# Altium schematic sheet RasBOB_board.SchDoc: RP2040 CNC
size C; Author: AM; CompanyName: Expatria Technologies; DrawnBy: A.Marles; Engineer: AM; Organization: Expatria Technolgoies; Address1: Schematic; DocumentNumber: 2; SheetNumber: 2; SheetTotal: 4
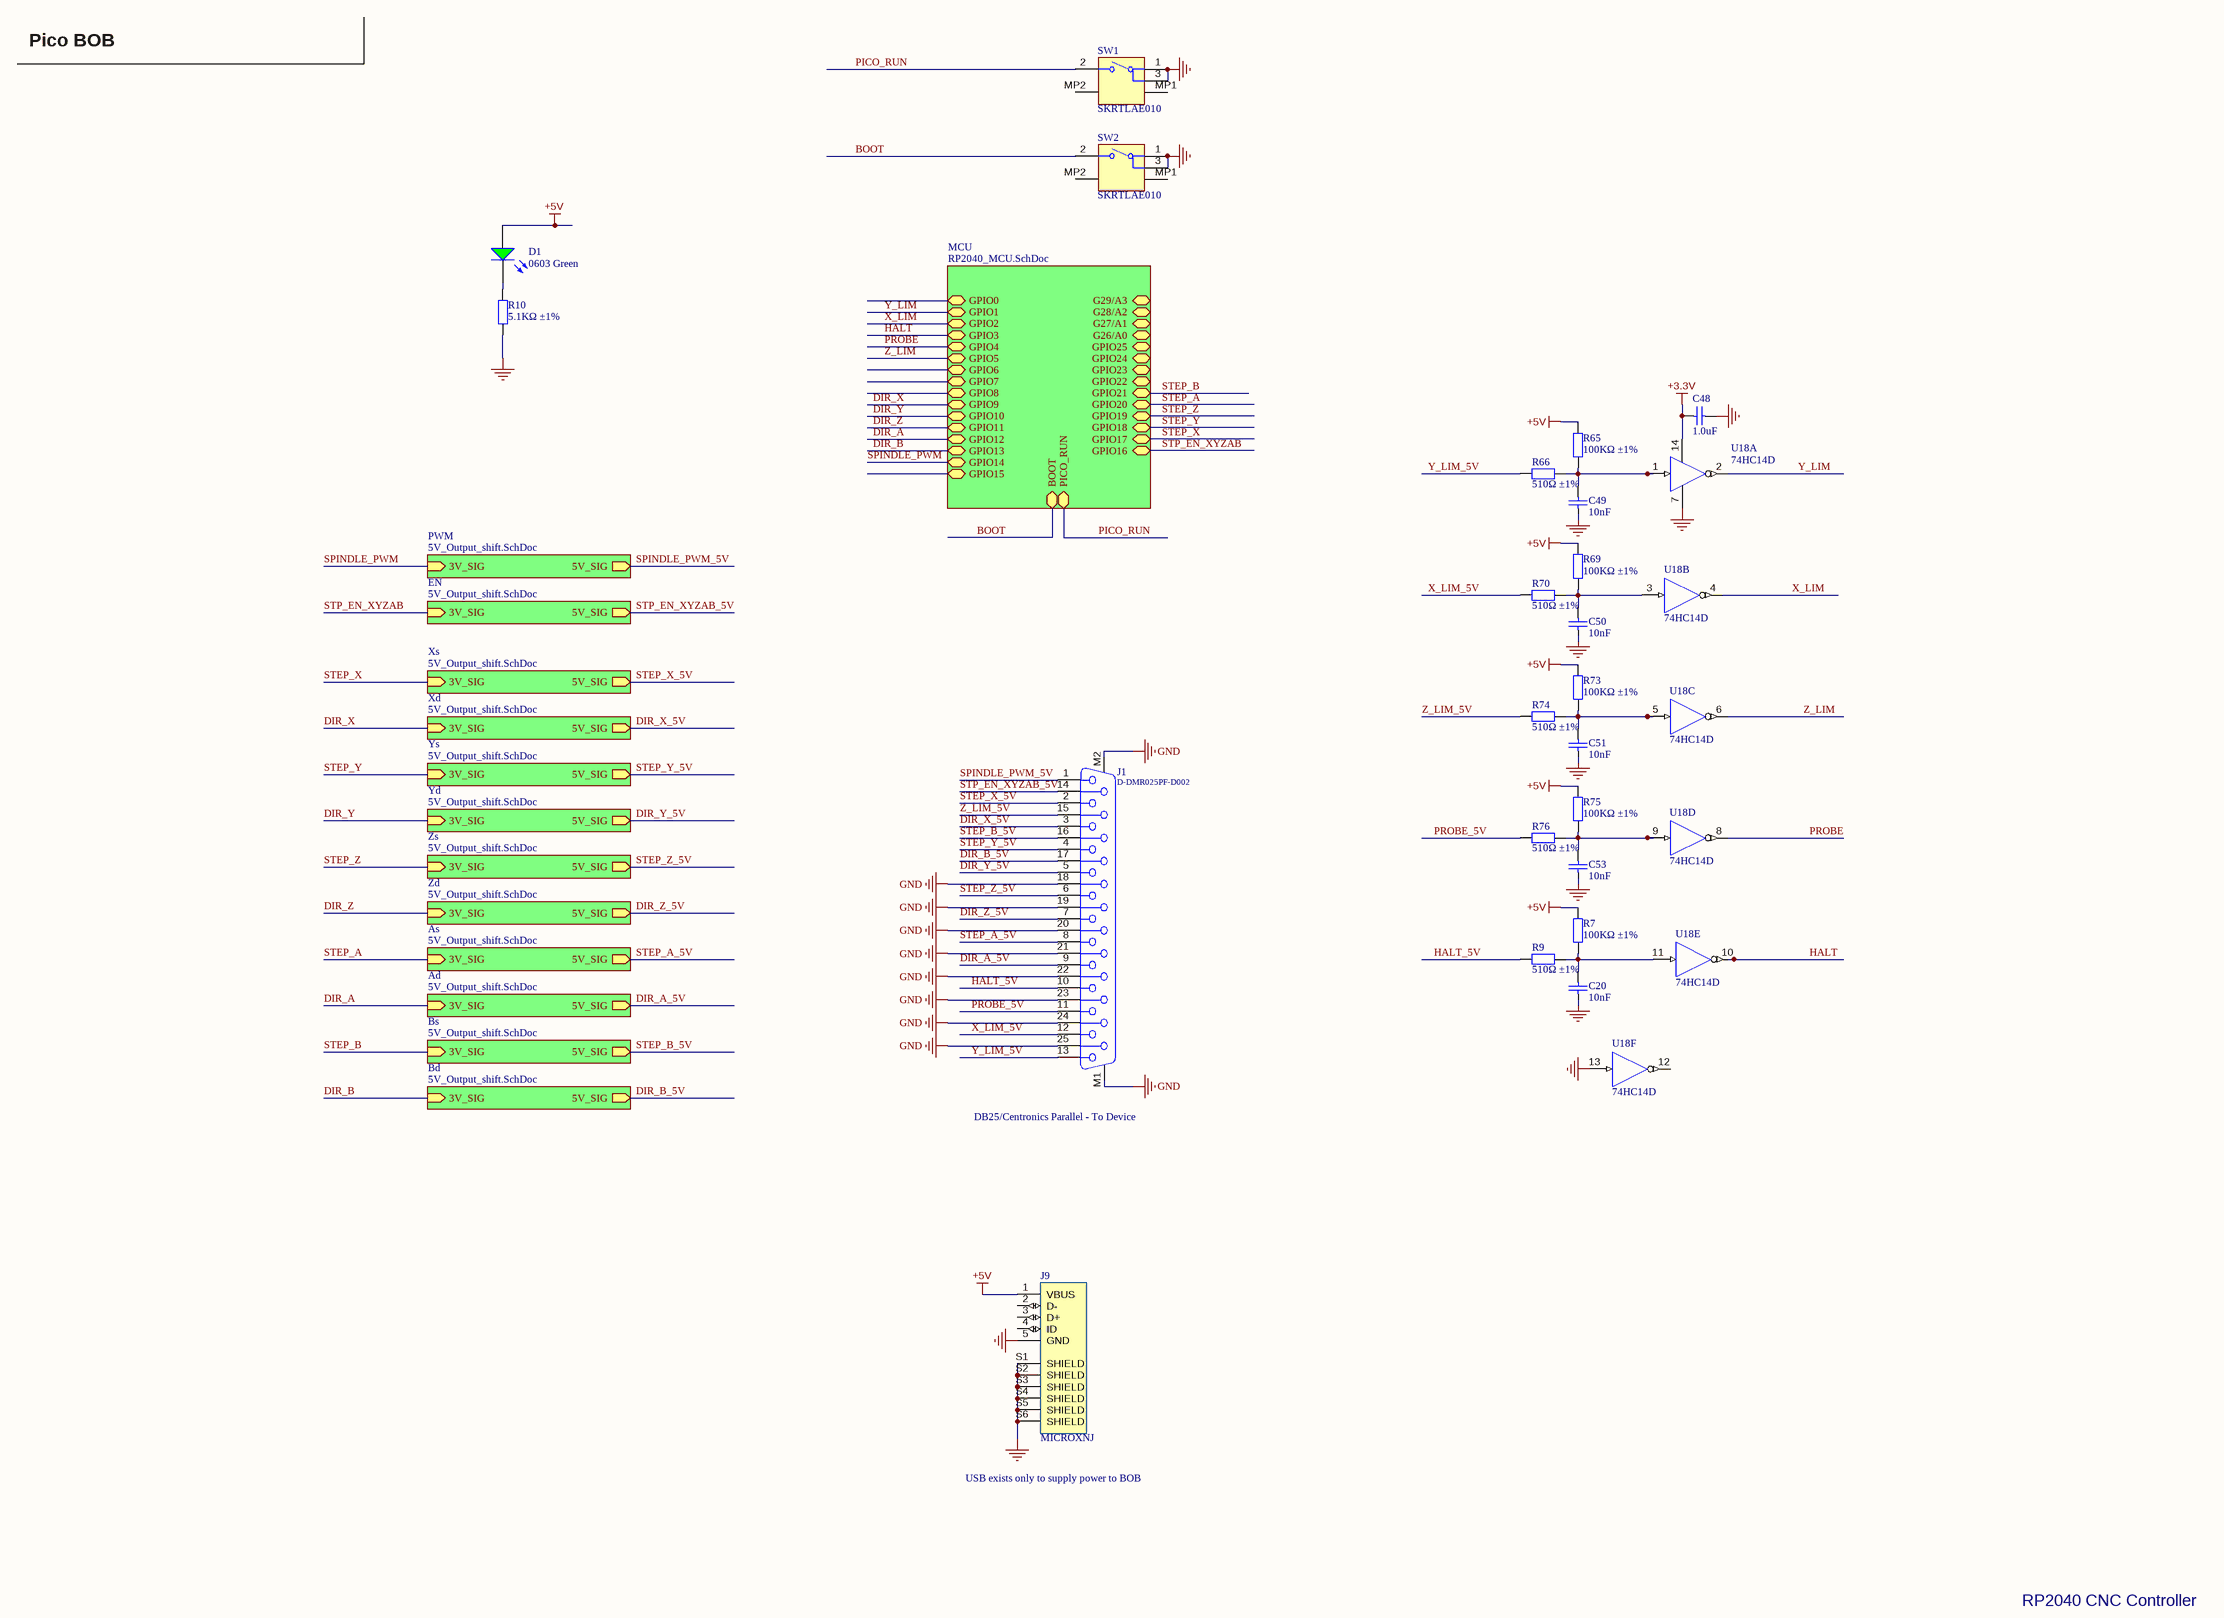
[diagram p0: RasBOB_board.SchDoc]

## Parts
C20  10nF  [0402_C]
C48  1.0uF  [0402_C]
C49  10nF  [0402_C]
C50  10nF  [0402_C]
C51  10nF  [0402_C]
C53  10nF  [0402_C]
D1  0603 Green  [0603_LED_S1]
J1  D-DMR025PF-D002  [618025231121]
J9  MICROXNJ  [SHOUHAN_MICROXNJ]
R7  100KΩ ±1%  [0402_R]
R9  510Ω ±1%  [0402_R]
R10  5.1KΩ ±1%  [0402_R]
R65  100KΩ ±1%  [0402_R]
R66  510Ω ±1%  [0402_R]
R69  100KΩ ±1%  [0402_R]
R70  510Ω ±1%  [0402_R]
R73  100KΩ ±1%  [0402_R]
R74  510Ω ±1%  [0402_R]
R75  100KΩ ±1%  [0402_R]
R76  510Ω ±1%  [0402_R]
SW1  SKRTLAE010  [ALPS-SKRTLAE010_V]
SW2  SKRTLAE010  [ALPS-SKRTLAE010_V]
U18  74HC14D  [SOIC-14_150mil]  (parts A,B,C,D,E,F of 6)

## Sub-sheets
Ad = 5V_Output_shift.SchDoc: 3V_SIG (in), 5V_SIG (out)
As = 5V_Output_shift.SchDoc: 3V_SIG (in), 5V_SIG (out)
Bd = 5V_Output_shift.SchDoc: 3V_SIG (in), 5V_SIG (out)
Bs = 5V_Output_shift.SchDoc: 3V_SIG (in), 5V_SIG (out)
EN = 5V_Output_shift.SchDoc: 3V_SIG (in), 5V_SIG (out)
MCU = RP2040_MCU.SchDoc: G28/A2 (bidir), GPIO20 (bidir), GPIO14 (bidir), GPIO25 (bidir), GPIO15 (bidir), GPIO8 (bidir), GPIO1 (bidir), G27/A1 (bidir), GPIO0 (bidir), GPIO13 (bidir), G26/A0 (bidir), GPIO21 (bidir), PICO_RUN (bidir), G29/A3 (bidir), GPIO7 (bidir), GPIO6 (bidir), GPIO12 (bidir), GPIO2 (bidir), GPIO4 (bidir), GPIO17 (bidir), GPIO10 (bidir), GPIO11 (bidir), GPIO23 (bidir), GPIO22 (bidir), GPIO18 (bidir), GPIO5 (bidir), GPIO9 (bidir), GPIO3 (bidir), GPIO24 (bidir), GPIO19 (bidir), GPIO16 (bidir), BOOT (bidir)
PWM = 5V_Output_shift.SchDoc: 3V_SIG (in), 5V_SIG (out)
Xd = 5V_Output_shift.SchDoc: 3V_SIG (in), 5V_SIG (out)
Xs = 5V_Output_shift.SchDoc: 3V_SIG (in), 5V_SIG (out)
Yd = 5V_Output_shift.SchDoc: 3V_SIG (in), 5V_SIG (out)
Ys = 5V_Output_shift.SchDoc: 3V_SIG (in), 5V_SIG (out)
Zd = 5V_Output_shift.SchDoc: 3V_SIG (in), 5V_SIG (out)
Zs = 5V_Output_shift.SchDoc: 3V_SIG (in), 5V_SIG (out)

## Nets
+3.3V: C48.1 U18.14(VDD)
+5V: D1.A J9.1(VBUS) R7.2 R65.2 R69.2 R73.2 R75.2
GND: C20.1 C48.2 C49.1 C50.1 C51.1 C53.1 J1.18 J1.19 J1.20 J1.21 J1.22 J1.23 J1.24 J1.25 J1.M1 J1.M2 J9.5(GND) J9.S1(SHIELD) J9.S2(SHIELD) J9.S3(SHIELD) J9.S4(SHIELD) J9.S5(SHIELD) J9.S6(SHIELD) R10.2 SW1.1 SW1.3 SW2.1 SW2.3 U18.7(GND) U18.13(A)
BOOT: SW2.2 ; sheet MCU/BOOT
DIR_A: sheet Ad/3V_SIG, sheet MCU/GPIO12
DIR_A_5V: J1.9 ; sheet Ad/5V_SIG
DIR_B: sheet Bd/3V_SIG, sheet MCU/GPIO13
DIR_B_5V: J1.17 ; sheet Bd/5V_SIG
DIR_X: sheet Xd/3V_SIG, sheet MCU/GPIO9
DIR_X_5V: J1.3 ; sheet Xd/5V_SIG
DIR_Y: sheet Yd/3V_SIG, sheet MCU/GPIO10
DIR_Y_5V: J1.5 ; sheet Yd/5V_SIG
DIR_Z: sheet Zd/3V_SIG, sheet MCU/GPIO11
DIR_Z_5V: J1.7 ; sheet Zd/5V_SIG
HALT: U18.10(Y) ; sheet MCU/GPIO3
HALT_5V: J1.10 R9.1
PICO_RUN: SW1.2 ; sheet MCU/PICO_RUN
PROBE: U18.8(Y) ; sheet MCU/GPIO4
PROBE_5V: J1.11 R76.1
SPINDLE_PWM: sheet PWM/3V_SIG, sheet MCU/GPIO14
SPINDLE_PWM_5V: J1.1 ; sheet PWM/5V_SIG
STEP_A: sheet As/3V_SIG, sheet MCU/GPIO20
STEP_A_5V: J1.8 ; sheet As/5V_SIG
STEP_B: sheet Bs/3V_SIG, sheet MCU/GPIO21
STEP_B_5V: J1.16 ; sheet Bs/5V_SIG
STEP_X: sheet Xs/3V_SIG, sheet MCU/GPIO17
STEP_X_5V: J1.2 ; sheet Xs/5V_SIG
STEP_Y: sheet Ys/3V_SIG, sheet MCU/GPIO18
STEP_Y_5V: J1.4 ; sheet Ys/5V_SIG
STEP_Z: sheet Zs/3V_SIG, sheet MCU/GPIO19
STEP_Z_5V: J1.6 ; sheet Zs/5V_SIG
STP_EN_XYZAB: sheet EN/3V_SIG, sheet MCU/GPIO16
STP_EN_XYZAB_5V: J1.14 ; sheet EN/5V_SIG
X_LIM: U18.4(Y) ; sheet MCU/GPIO2
X_LIM_5V: J1.12 R70.1
Y_LIM: U18.2(Y) ; sheet MCU/GPIO1
Y_LIM_5V: J1.13 R66.1
Z_LIM: U18.6(Y) ; sheet MCU/GPIO5
Z_LIM_5V: J1.15 R74.1
NetC20_2: C20.2 R7.1 R9.2 U18.11(A)
NetC49_2: C49.2 R65.1 R66.2 U18.1(A)
NetC50_2: C50.2 R69.1 R70.2 U18.3(A)
NetC51_2: C51.2 R73.1 R74.2 U18.5(A)
NetC53_2: C53.2 R75.1 R76.2 U18.9(A)
NetD1_K: D1.K R10.1

Not connected (* = marked no-connect by the designer): J9 2(D-) 3(D+) 4(ID); SW1 MP1 MP2; SW2 MP1 MP2; U18 12(Y)

## Notes on the sheet
- Pico BOB
- DB25/Centronics Parallel - To Device
- USB exists only to supply power to BOB
- RP2040 CNC Controller
- Expatria Technologies
- SHEET
- PROJECT
- REV
- 1136 Glade Court
- Port Coquitlam, BC V3B 1R5
- EMAIL: INFO@EXPATRIA.CA
- SIZE
- ENGR
- C
- MODIFIED
- DOCUMENT
- /
- Copyright Expatria Technologies 2022. This document describes Open Hardware and is licensed under the CERN-OHL-S v2. No warranty is implied or expressed.

## Library data of the parts
C20 C49-C51 C53 = 0402 10nF (103) 10% 50V: Chip capacitors; Manufacturer: Samsung Electro-Mechanics; PartNumber: CL05B103KB5NNNC; Tolerance: 10%; Voltage: 50V; ComponentLink1Description: Supplier link; ComponentLink1URL: http://www.szlcsc.com/product/details_15869.html; Package: 0402; Supplier: LC; SuppliersPartNumber: C15195; Capacitance: 10nF
C48 = 0402 1.0uF (105) 10% 25V: Chip capacitor; Manufacturer: Samsung Electro-Mechanics; PartNumber: CL05A105KA5NQNC; Capacitance: 1uF; Tolerance: 10%; Voltage: 25V; ComponentLink1Description: Supplier link; ComponentLink1URL: http://www.szlcsc.com/product/details_53938.html; Package: 0402; Supplier: LC; SuppliersPartNumber: C52923
D1 = 0603 LED Green: LED; ComponentLink1Description: 供应商链接; ComponentLink1URL: http://www.szlcsc.com/product/details_73152.html; Package: 0603; Supplier: LC; SuppliersPartNumber: C72043; Color: Green
J1 = CMP-1502-00202-1: Through Hole,P=2.77mm D-Sub Connectors ROHS; SuppliersPartNumber: C190083; PartNumber: D-DMR025PF-D002
J9 = MICROXNJ: Micro USB; MF: Shouhan; Package: Package; SuppliersPartNumber: C404969; Check_prices: https://www.snapeda.com/parts/MICROXNJ/Shouhan/view-part/5703693/?ref=eda; Price: None; SnapEDA_Link: https://www.snapeda.com/parts/MICROXNJ/Shouhan/view-part/5703693/?ref=snap; Availability: Unavailable; MP: MICROXNJ; Value: *
R7 R65 R69 R73 R75 = 0402 100K (1003) 1%: Chip resistor; Manufacturer: Uniroyal Elec; PartNumber: 0402WGF1003TCE; Power: 1/16W; ComponentLink1Description: Supplier link; ComponentLink1URL: http://www.szlcsc.com/product/details_26484.html; Package: 0402; Supplier: LC; SuppliersPartNumber: C25741; Resistance: 100KΩ; Tolerance: 1%
R9 R66 R70 R74 R76 = 0402 510R (5100) 1%: Chip resistor; Manufacturer: Uniroyal Elec; PartNumber: 0402WGF5100TCE; Power: 1/16W; ComponentLink1Description: Supplier link; ComponentLink1URL: http://www.szlcsc.com/product/details_25866.html; Package: 0402; Supplier: LC; SuppliersPartNumber: C25123; Resistance: 510Ω; Tolerance: 1%
R10 = 0402 5.1K (5101) 1%: Chip resistor; Manufacturer: Uniroyal Elec; PartNumber: 0402WGF5101TCE; Power: 1/16W; Resistance: 51.1KΩ; ComponentLink1Description: Supplier link; ComponentLink1URL: http://www.szlcsc.com/product/details_26648.html; Package: 0402; Supplier: LC; SuppliersPartNumber: C25905; Tolerance: 1%
SW1 SW2 = CMP-2000-07073-2: Side Push Type, 250 V, -40 to 90 degC, 3-Pin SMD, RoHS, Tape and Reel; Manufacturer: ALPS; Operating Force: 1.6N; Folder: Unified Components\Components\New Releases\New\; Maximum Current Rating: 0.05@12VDCA; RevisionId: 1; Pole Throw Configuration: SPST; Switch Configuration: N.O.; AccessRights: 2147483647; Maximum DC Voltage Rating: 12V; ContentType: Unified Component; Rad Hard: No; Mounting: SurfaceMount; Datasheet URL: http://www.alps.com/prod/info/E/PDF/Tact/SurfaceMount/SKRT/SKRT.PDF; Manufacturer URL: http://www.alps.com/e/; ReleaseDate: 22/09/2017 06:13:25 AM; ItemHRID: CMP-2000-07073; ContentTypeGUID: CB3C11C4-E317-11DF-B822-12313F0024A2; LifeCycle: Released; ItemGUID: EAC55BEC-37DC-4BDB-8BA7-D75E6D5C3D75; Packaging: Tape&Reel; Package Reference: SKRTLAE010; FolderGUID: B7F4506A-9127-42E7-A087-46FE7B18D116; Datasheet Version: 06/2015; Mounting Technology: SurfaceMount; LifeCycleStateGUID: 61E382EE-6656-4F12-9E24-BE9327104A25; Package Description: 3-Pin Surface Mount Device, Body 4.5 x 3.55 mm, Pitch 1.225 mm; SuppliersPartNumber: C110293; Manufacturer 1: ALPS
U18 = 74HC14D_[C5605]: 74系列逻辑芯片; ComponentLink1Description: 供应商链接; ComponentLink1URL: http://www.szlcsc.com/product/details_6056.html; Package: SOIC-14_150mil; Supplier: LC; SuppliersPartNumber: C5605